# Altium schematic sheet Pump_shield.schdoc
size A4; Organization: ECAM; Revision: 0; SheetNumber: 1; SheetTotal: 1
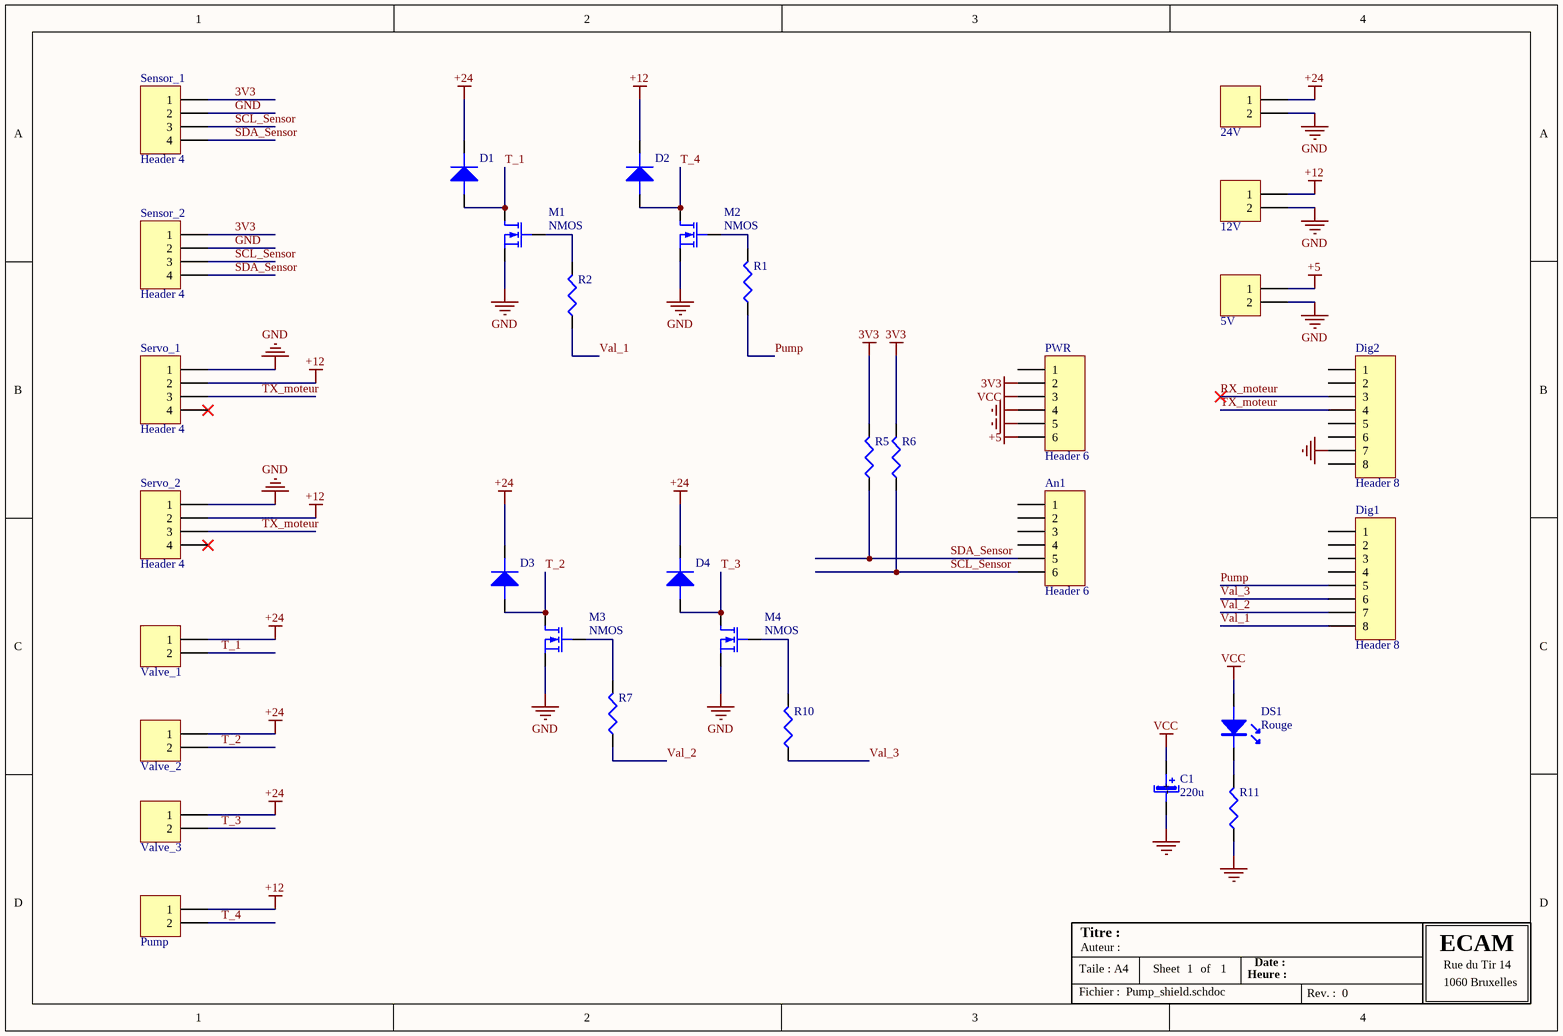
[diagram p0: Pump_shield.schdoc]

## Parts
5V  Connecteur 2  [Header_2]  (value not drawn)
12V  Connecteur 2  [Header_2]  (value not drawn)
24V  Connecteur 2  [Header_2]  (value not drawn)
An1  Header 6  [HDR1X6]
C1  value 220u  [CAPAE0810X700N]  (hidden comment: Cap_220u)
D1  Diode  [DIO7.1-3.9x1.9]  (value not drawn)
D2  Diode  [DIO7.1-3.9x1.9]  (value not drawn)
D3  Diode  [DIO7.1-3.9x1.9]  (value not drawn)
D4  Diode  [DIO7.1-3.9x1.9]  (value not drawn)
Dig1  Header 8  [HDR1X8]
Dig2  Header 8  [HDR1X8]
DS1  Color: Rouge  [LED 0.1]  (hidden comment: LED)
M1  value NMOS  [TO-92bis_MOS-N]  (hidden comment: MOSFET-N)
M2  value NMOS  [TO-220_MOS-N]  (hidden comment: MOSFET-N)
M3  value NMOS  [TO-92bis_MOS-N]  (hidden comment: MOSFET-N)
M4  value NMOS  [TO-92bis_MOS-N]  (hidden comment: MOSFET-N)
Pump  Connecteur 2  [Header_2]  (value not drawn)
PWR  Header 6  [HDR1X6]
R1  Résistance  [AXIAL-0.4]  (value not drawn)
R2  Résistance  [AXIAL-0.4]  (value not drawn)
R5  Résistance  [AXIAL-0.4]  (value not drawn)
R6  Résistance  [AXIAL-0.4]  (value not drawn)
R7  Résistance  [AXIAL-0.4]  (value not drawn)
R10  Résistance  [AXIAL-0.4]  (value not drawn)
R11  Résistance  [AXIAL-0.4]  (value not drawn)
Sensor_1  Header 4  [Header_4]
Sensor_2  Header 4  [Header_4]
Servo_1  Header 4  [Header_4]
Servo_2  Header 4  [Header_4]
Valve_1  Connecteur 2  [Header_2]  (value not drawn)
Valve_2  Connecteur 2  [Header_2]  (value not drawn)
Valve_3  Connecteur 2  [Header_2]  (value not drawn)

## Nets
3V3: PWR.2 R5.2 R6.2 Sensor_1.1 Sensor_2.1
+5: 5V.1 PWR.6
+12: 12V.1 D2.2(K) Pump.1 Servo_1.2 Servo_2.2
+24: 24V.1 D1.2(K) D3.2(K) D4.2(K) Valve_1.1 Valve_2.1 Valve_3.1
GND: 5V.2 12V.2 24V.2 C1.NEG(-) Dig2.7 M1.S M2.S M3.S M4.S PWR.4 PWR.5 R11.1 Sensor_1.2 Sensor_2.2 Servo_1.1 Servo_2.1
VCC: C1.POS(+) DS1.1(A) PWR.3
Pump: Dig1.5 R1.1
RX_moteur: Dig2.3
SCL_Sensor: An1.6 R6.1 Sensor_1.3 Sensor_2.3
SDA_Sensor: An1.5 R5.1 Sensor_1.4 Sensor_2.4
T_1: D1.1(A) M1.D Valve_1.2
T_2: D3.1(A) M3.D Valve_2.2
T_3: D4.1(A) M4.D Valve_3.2
T_4: D2.1(A) M2.D Pump.2
TX_moteur: Dig2.4 Servo_1.3 Servo_2.3
Val_1: Dig1.8 R2.1
Val_2: Dig1.7 R7.1
Val_3: Dig1.6 R10.1
NetDS1_2: DS1.2(K) R11.2
NetM1_G: M1.G R2.2
NetM2_G: M2.G R1.2
NetM3_G: M3.G R7.2
NetM4_G: M4.G R10.2

Not connected (* = marked no-connect by the designer): An1 1 2 3 4; Dig1 1 2 3 4; Dig2 1 2 5 6 8; PWR 1; Servo_1 4*; Servo_2 4*

## Notes on the sheet
- Taile : A4
- Titre :
- Auteur :
- Sheet
- of
- Heure :
- Date :
- ECAM
- Rue du Tir 14
- 1060 Bruxelles
- Fichier :
- Rev. :

## Library data of the parts
5V 12V 24V Pump Valve_1-Valve_3 = Connecteur 2: Header 2; Designer: ECAM 2005; Supplier: ECAM; Type: Connecteur à vis
An1 PWR = Header 6: Header, 6-Pin; LatestRevisionDate: 17-Jul-2002; LatestRevisionNote: Re-released for DXP Platform.; Publisher: Altium Limited
C1 = Cap_220u: Condensateur polatisé; Type: Condensateur polarisé debout; Designer: ECAM 2004; Supplier: RS 537-0641
D1-D4 = Diode: Type: Diode standard; Designer: ECAM 2003
Dig1 Dig2 = Header 8: Header, 8-Pin; LatestRevisionDate: 17-Jul-2002; LatestRevisionNote: Re-released for DXP Platform.; Publisher: Altium Limited
M1-M4 = MOSFET-N: MOSFET; Designer: ECAM 2002; Type: Mosfet canal N
R1 R2 R5-R7 R10 R11 = Résistance: Résistance standard; Designer: ECAM 2005; Type: Résistance standard
Sensor_1 Sensor_2 Servo_1 Servo_2 = Header 4: Header, 4-Pin; LatestRevisionDate: 17-Jul-2002; LatestRevisionNote: Re-released for DXP Platform.; Publisher: Altium Limited; Supplier: Farnell 9731164
DS1 = LED: Designer: ECAM 2004; Type: LED